# Altium schematic sheet Fan_driver.SchDoc
size A; SheetNumber: 7; SheetTotal: 8
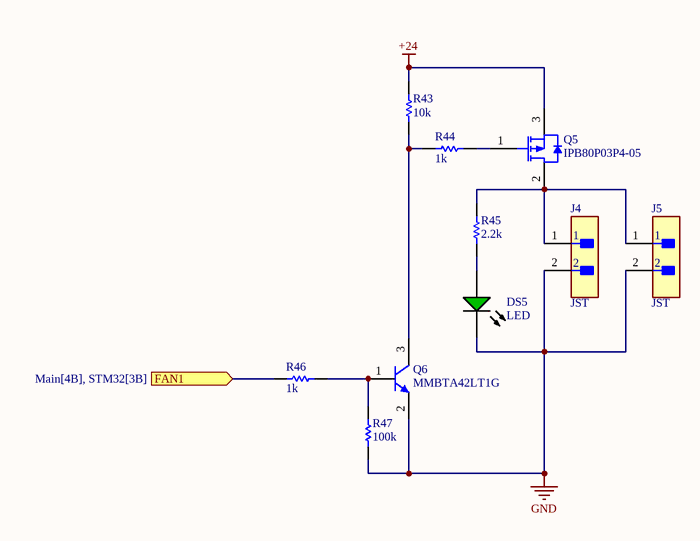
[diagram p0: Fan_driver.SchDoc]

## Parts
DS5  LED  [AVAG-HSMX-C170_V]
J4  JST  [FP-B2B-EH-A_LF_SN-MFG]
J5  JST  [FP-B2B-EH-A_LF_SN-MFG]
Q5  IPB80P03P4-05  [INF-PG-TO263-3-2_N]
Q6  MMBTA42LT1G  [ONSC-SOT-23-3-318-08_V]
R43  10k  [RESC2013X50X30LL20T20]
R44  1k  [RESC2013X50X30LL20T20]
R45  2.2k  [RESC2013X50X30LL20T20]
R46  1k  [RESC2013X50X30LL20T20]
R47  100k  [RESC2013X50X30LL20T20]

## Ports
FAN1 (in, see Main[4B], STM32[3B])

## Nets
+24: Q5.3(SOURCE) R43.2
GND: DS5.2(K) J4.2 J5.2 Q6.2(E) R47.1
FAN1: R46.1 ; port FAN1
NetDS5_1: DS5.1(A) R45.1
NetJ4_1: J4.1 J5.1 Q5.2(DRAIN) R45.2
NetQ5_1: Q5.1(GATE) R44.2
NetQ6_1: Q6.1(B) R46.2 R47.2
NetQ6_3: Q6.3(C) R43.1 R44.1

## Library data of the parts
DS5 = CMP-2000-05062-1: Chip LED, Green, 2.2 V, -40 to 85 degC, 2-Pin SMD, Pb-Free, Tape and Reel; Manufacturer: Avago; No. of Pins: 2; Peak Wavelength: 570nm; SVHC: NoSVHC(16-Jun-2014); Dominant Wavelength: 572nm; Forward Current If: 20mA; Viewing Angle: 170deg; Lens Shape: Rectangular; PIV Max: 5V; External Width: 1.25mm; LED Type: Standard; External Depth: 0.8mm; Opto Mounting Orientation: Top; Luminous Intensity: 15mcd; Luminous Intensity Min: 4mcd; Forward Voltage VF Max: 2.6V; External Length / Height: 2mm; Bulb Size: 1.25mmx1.4mm; Light Area Height: 1mm; Voltage Vf Typ: 2.2V; Operating Temperature Max: 85degC; Datasheet Version: Oct-08; MSL: MSL2A-4weeks; Peak Forward Current: 20mA; Package Description: 2-Pin Surface Mount Device, Body 2 x 1.25 mm, Height 0.8 mm; Datasheet URL: https://datasheet.ciiva.com/29280/180495-da-01-en-chip-led-hsmg-c170-gelb-gruen-29280971.pdf; Storage Temperature Min: -40degC; LED Colour: Green; Wavelength Typ: 570nm; Mounting Type: SMD; Forward Current If Max: 20mA; Dominant Wavelength Typ: 572nm; LED Mounting: SMD; Operating Temperature Range: -30degCto+85degC; Operating Temperature Min: -30degC; Manufacturer URL: http://www.avagotech.com/; Packaging: CutTape; Luminous Intensity Typ: 15mcd; Package Reference: HSMX-C170; Storage Temperature Max: 85degC; Opto Case Style: SMD; Forward Voltage: 2.2V
J4 J5 = CMP-17439-000026-1: CONN HEADER VERT 2POS 2.5MM; Number of Contacts: 2; Current Rating: 3A; Connector Type: Plug; Contact Resistance: 20mR; Gender: Male; Voltage Rating: 250V; Fastening Type: Detent; Depth: 3.8mm; Max Operating Temperature: 85°C; Orientation: Straight; Series: EH; Contact Plating: Tin; Min Operating Temperature: -25°C; Contact Type: Male Pin; Housing Color: White; Termination: Press-Fit; Housing Material: Nylon; Pitch: 2.5mm; Number of Positions: 2; Max Current Rating: 3A; Packaging: Bulk; Lead Free: Lead Free; Number of Rows: 1; Length: 7.5mm; Contact Mating Length: 0.13inch; Color: Natural; Max Voltage Rating (AC): 250V; Contact Material: Copper Alloy; Mount: Through Hole
Q5 = CMP-1138-00228-1: OptiMOS-P2 Power-Transistor, -30 V VDS, -80 A ID, PG-TO263-3-2, Reel, Green; Manufacturer: Infineon; Green: TRUE; RthJC (max): 1.1 K/W; RDS (on) (max) (@10V): 4.7 mOhm; VGS(th) (max): -4 V; QG: 100 nC; ID (max): -80 A; IDpuls (max): -320 A; VDS (max): -30 V; Ptot (max): 137 W; VGS(th) (min): -2 V; DatasheetVersion: Rev. 1.0; PackageReference: PG-TO263-3-2; ComponentLink1Description: Manufacturer URL; Mounting Technology: Surface Mount; PackageDescription: 3-Pin Plastic (Green) Transistor Single Outline Package, 10 x 9.25 mm Body, 2.54 mm Pitch; ComponentLink2URL: http://www.infineon.com/dgdl/IPP_B_I80P03P4-05_DS_10.pdf?folderId=db3a304314dca3890114ef902baa05f9&fileId=db3a30431ddc9372011e07ef59f52807&location=en.Products.Automotive_ICs.Automotive_MOSFETs.Single__P-Channel_30V_MOSFETs.DATASHEET.IPP_B_I80P03P4-05_DS_1; ComponentLink3Description: Package Specification; ComponentLink2Description: Datasheet; ComponentLink3URL: http://www.infineon.com/dgdl/BTS141TC_DS_10.pdf?folderId=db3a3043163797a6011667aa084c0e01&fileId=db3a3043242ebc9e01242f43f58b003e&location=en.Products.Automotive_ICs.Smart_High-_and_Low-Side_Switches.HITFET___TEMPFET__-_Smart_Low-Side_Switches.DATASHEET.BT; Halogen-free: TRUE; Technology: OptiMOS-P2; Packing: Reel; PartNumber: IPB80P03P4-05; ComponentLink1URL: http://www.infineon.com/; PackageVersion: Jul-09
Q6 = CMP-1048-00662-1: High Voltage Transistor, NPN Silicon, 3-Pin SOT-23, Pb-Free, Tape and Reel; Manufacturer: On Semiconductor; fT Min (MHz): 50; IC Continuous (A): 0.5; ComponentLink1URL: http://www.onsemi.com/; ComponentLink3URL: http://www.onsemi.cn/pub_link/Collateral/318-08.PDF; RoHS: TRUE; ComponentLink2Description: Datasheet; PartNumber: MMBTA42LT1G; Polarity: NPN; DatasheetVersion: Rev. 12; PackageReference: SOT-23-3-318-08; PackageDescription: 3-Pin Small Outline Transistor, Body 2.92 x 1.3 mm, Pitch 0.95 mm; ComponentLink3Description: Package Specification; ComponentLink1Description: Manufacturer URL; Packing: Tape and Reel; PackageVersion: Rev. AP, 11/2009; Mounting Technology: Surface Mount; ComponentLink2URL: http://www.onsemi.cn/pub_link/Collateral/MMBTA42LT1-D.PDF
R43-R47 = CMP-2001-04896-1: Manufacturer: Vishay Dale; Part Number: CRCW08050000Z0EA